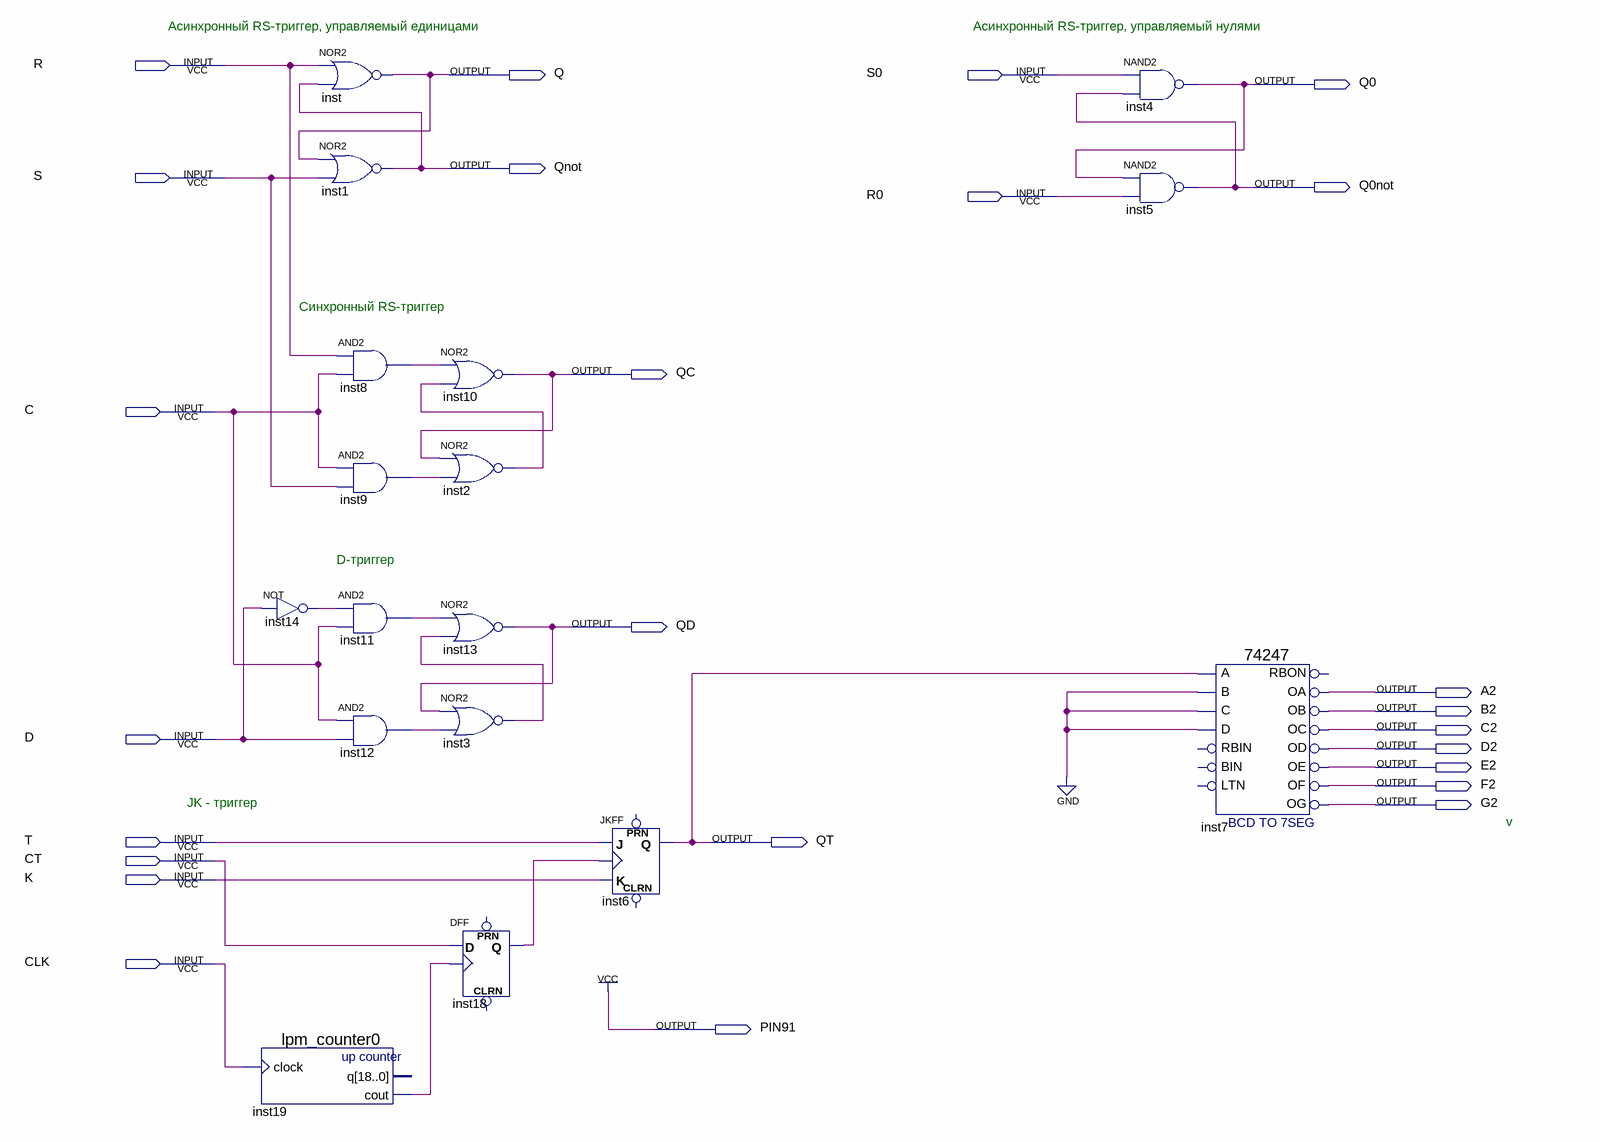
[diagram p0: schematic sheet]
// Quartus schematic Triggers.bdf as structural Verilog: 17 symbols, 25 pins
module Triggers (
  input  R,
  input  S0,
  input  S,
  input  R0,
  input  C,
  input  D,
  input  T,
  input  CT,
  input  K,
  input  CLK,
  output Q,
  output Q0,
  output Qnot,
  output Q0not,
  output QC,
  output QD,
  output A2,
  output B2,
  output C2,
  output D2,
  output E2,
  output F2,
  output G2,
  output QT,
  output PIN91
);

  wire inst2_out, inst3_out, inst8_out, inst9_out, inst11_out, inst12_out, inst14_out, inst18_q, inst19_cout;

  lpm_counter0 inst19 (.clock(CLK), .cout(inst19_cout));  // open: q
  nor inst (Q, R, Qnot);
  nor inst1 (Qnot, Q, S);
  not inst14 (inst14_out, D);
  and inst8 (inst8_out, R, C);
  and inst9 (inst9_out, C, S);
  and inst11 (inst11_out, inst14_out, C);
  and inst12 (inst12_out, C, D);
  nor inst10 (QC, inst8_out, inst2_out);
  nor inst2 (inst2_out, QC, inst9_out);
  nor inst13 (QD, inst11_out, inst3_out);
  nor inst3 (inst3_out, QD, inst12_out);
  DFF inst18 (.CLK(inst19_cout), .D(CT), .Q(inst18_q));  // open: CLRN, PRN
  JKFF inst6 (.K(K), .J(T), .CLK(inst18_q), .Q(QT));  // open: PRN, CLRN
  nand inst4 (Q0, S0, Q0not);
  nand inst5 (Q0not, Q0, R0);
  \74247  inst7 (
    .A(QT), .B(1'b0), .C(1'b0), .D(1'b0), .OF(F2), .OC(C2), .OD(D2), .OE(E2), .OA(A2), .OB(B2), .OG(G2));  // open: LTN, BIN, RBIN, RBON

  assign PIN91 = 1'b1;

  // Notes on the sheet:
  //   Асинхронный RS-триггер, управляемый единицами
  //   Асинхронный RS-триггер, управляемый нулями
  //   Синхронный RS-триггер
  //   D-триггер
  //   JK - триггер
  //   v
endmodule
